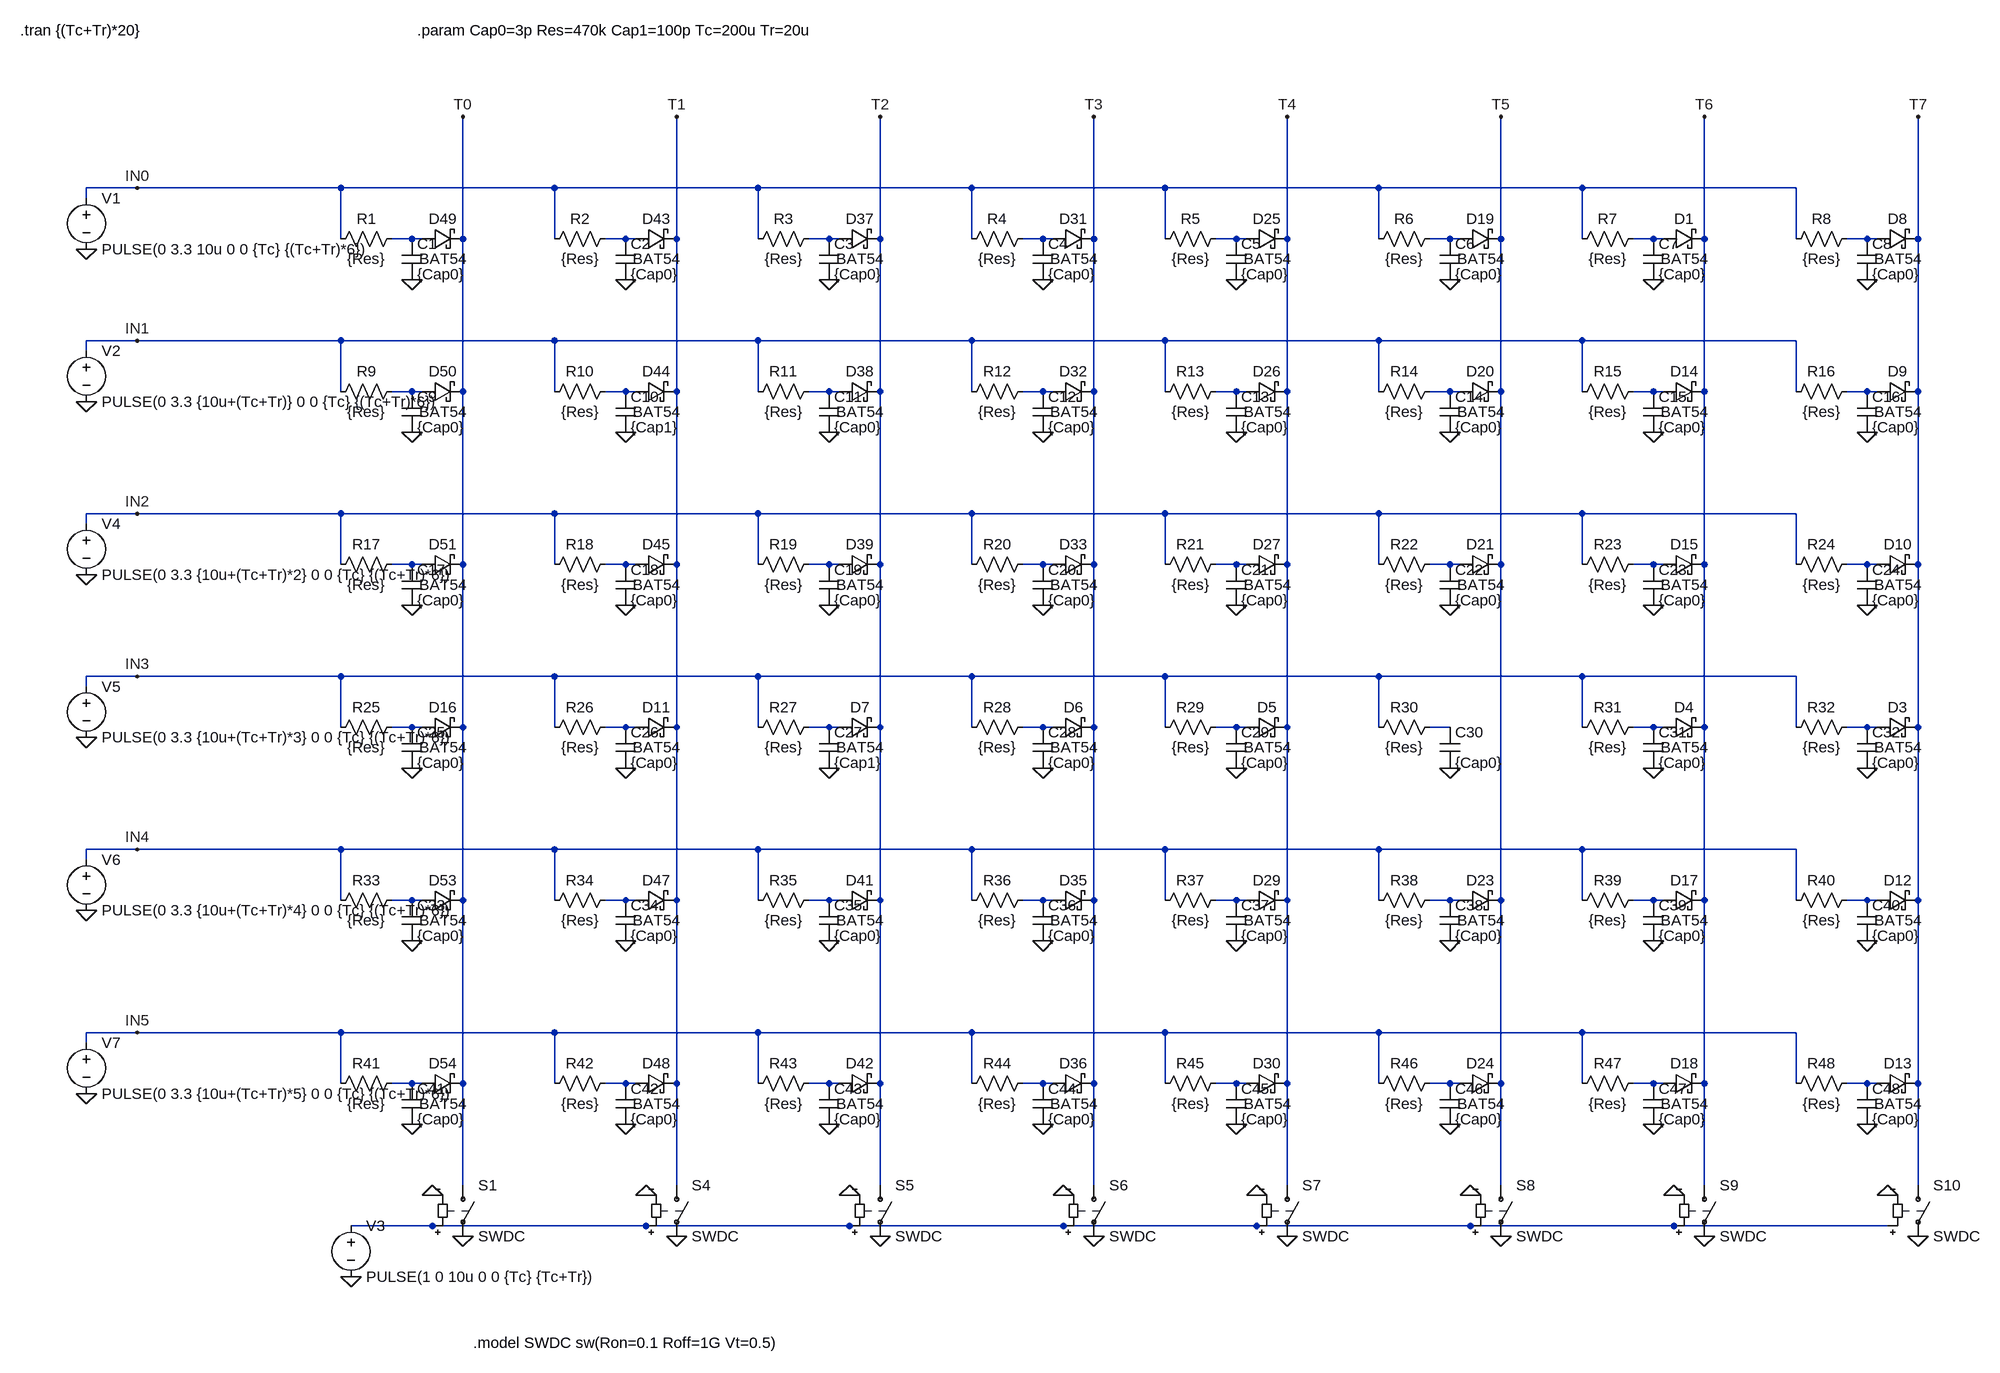
[diagram p0: schematic PadArraySim.asc]
PadArraySim.asc, the LTspice schematic file:
Version 4
SHEET 1 2744 2100
WIRE -336 128 -416 128
WIRE -16 128 -336 128
WIRE 320 128 -16 128
WIRE 640 128 320 128
WIRE 976 128 640 128
WIRE 1280 128 976 128
WIRE 1616 128 1280 128
WIRE 1936 128 1616 128
WIRE 2272 128 1936 128
WIRE -416 144 -416 128
WIRE -16 208 -16 128
WIRE 96 208 64 208
WIRE 112 208 96 208
WIRE 176 208 176 16
WIRE 320 208 320 128
WIRE 432 208 400 208
WIRE 448 208 432 208
WIRE 512 208 512 16
WIRE 640 208 640 128
WIRE 752 208 720 208
WIRE 768 208 752 208
WIRE 832 208 832 16
WIRE 976 208 976 128
WIRE 1088 208 1056 208
WIRE 1104 208 1088 208
WIRE 1168 208 1168 16
WIRE 1280 208 1280 128
WIRE 1392 208 1360 208
WIRE 1408 208 1392 208
WIRE 1472 208 1472 16
WIRE 1616 208 1616 128
WIRE 1728 208 1696 208
WIRE 1744 208 1728 208
WIRE 1808 208 1808 16
WIRE 1936 208 1936 128
WIRE 2048 208 2016 208
WIRE 2064 208 2048 208
WIRE 2128 208 2128 16
WIRE 2272 208 2272 128
WIRE 2384 208 2352 208
WIRE 2400 208 2384 208
WIRE 2464 208 2464 16
WIRE -336 368 -416 368
WIRE -16 368 -336 368
WIRE 320 368 -16 368
WIRE 640 368 320 368
WIRE 976 368 640 368
WIRE 1280 368 976 368
WIRE 1616 368 1280 368
WIRE 1936 368 1616 368
WIRE 2272 368 1936 368
WIRE -416 384 -416 368
WIRE -16 448 -16 368
WIRE 96 448 64 448
WIRE 112 448 96 448
WIRE 176 448 176 208
WIRE 320 448 320 368
WIRE 432 448 400 448
WIRE 448 448 432 448
WIRE 512 448 512 208
WIRE 640 448 640 368
WIRE 752 448 720 448
WIRE 768 448 752 448
WIRE 832 448 832 208
WIRE 976 448 976 368
WIRE 1088 448 1056 448
WIRE 1104 448 1088 448
WIRE 1168 448 1168 208
WIRE 1280 448 1280 368
WIRE 1392 448 1360 448
WIRE 1408 448 1392 448
WIRE 1472 448 1472 208
WIRE 1616 448 1616 368
WIRE 1728 448 1696 448
WIRE 1744 448 1728 448
WIRE 1808 448 1808 208
WIRE 1936 448 1936 368
WIRE 2048 448 2016 448
WIRE 2064 448 2048 448
WIRE 2128 448 2128 208
WIRE 2272 448 2272 368
WIRE 2384 448 2352 448
WIRE 2400 448 2384 448
WIRE 2464 448 2464 208
WIRE -336 640 -416 640
WIRE -16 640 -336 640
WIRE 320 640 -16 640
WIRE 640 640 320 640
WIRE 976 640 640 640
WIRE 1280 640 976 640
WIRE 1616 640 1280 640
WIRE 1936 640 1616 640
WIRE 2272 640 1936 640
WIRE -416 656 -416 640
WIRE -16 720 -16 640
WIRE 96 720 64 720
WIRE 112 720 96 720
WIRE 176 720 176 448
WIRE 320 720 320 640
WIRE 432 720 400 720
WIRE 448 720 432 720
WIRE 512 720 512 448
WIRE 640 720 640 640
WIRE 752 720 720 720
WIRE 768 720 752 720
WIRE 832 720 832 448
WIRE 976 720 976 640
WIRE 1088 720 1056 720
WIRE 1104 720 1088 720
WIRE 1168 720 1168 448
WIRE 1280 720 1280 640
WIRE 1392 720 1360 720
WIRE 1408 720 1392 720
WIRE 1472 720 1472 448
WIRE 1616 720 1616 640
WIRE 1728 720 1696 720
WIRE 1744 720 1728 720
WIRE 1808 720 1808 448
WIRE 1936 720 1936 640
WIRE 2048 720 2016 720
WIRE 2064 720 2048 720
WIRE 2128 720 2128 448
WIRE 2272 720 2272 640
WIRE 2384 720 2352 720
WIRE 2400 720 2384 720
WIRE 2464 720 2464 448
WIRE -336 896 -416 896
WIRE -16 896 -336 896
WIRE 320 896 -16 896
WIRE 640 896 320 896
WIRE 976 896 640 896
WIRE 1280 896 976 896
WIRE 1616 896 1280 896
WIRE 1936 896 1616 896
WIRE 2272 896 1936 896
WIRE -416 912 -416 896
WIRE -16 976 -16 896
WIRE 96 976 64 976
WIRE 112 976 96 976
WIRE 176 976 176 720
WIRE 320 976 320 896
WIRE 432 976 400 976
WIRE 448 976 432 976
WIRE 512 976 512 720
WIRE 640 976 640 896
WIRE 752 976 720 976
WIRE 768 976 752 976
WIRE 832 976 832 720
WIRE 976 976 976 896
WIRE 1088 976 1056 976
WIRE 1104 976 1088 976
WIRE 1168 976 1168 720
WIRE 1280 976 1280 896
WIRE 1392 976 1360 976
WIRE 1408 976 1392 976
WIRE 1472 976 1472 720
WIRE 1616 976 1616 896
WIRE 1728 976 1696 976
WIRE 1936 976 1936 896
WIRE 2048 976 2016 976
WIRE 2064 976 2048 976
WIRE 2128 976 2128 720
WIRE 2272 976 2272 896
WIRE 2384 976 2352 976
WIRE 2400 976 2384 976
WIRE 2464 976 2464 720
WIRE -336 1168 -416 1168
WIRE -16 1168 -336 1168
WIRE 320 1168 -16 1168
WIRE 640 1168 320 1168
WIRE 976 1168 640 1168
WIRE 1280 1168 976 1168
WIRE 1616 1168 1280 1168
WIRE 1936 1168 1616 1168
WIRE 2272 1168 1936 1168
WIRE -416 1184 -416 1168
WIRE -16 1248 -16 1168
WIRE 96 1248 64 1248
WIRE 112 1248 96 1248
WIRE 176 1248 176 976
WIRE 320 1248 320 1168
WIRE 432 1248 400 1248
WIRE 448 1248 432 1248
WIRE 512 1248 512 976
WIRE 640 1248 640 1168
WIRE 752 1248 720 1248
WIRE 768 1248 752 1248
WIRE 832 1248 832 976
WIRE 976 1248 976 1168
WIRE 1088 1248 1056 1248
WIRE 1104 1248 1088 1248
WIRE 1168 1248 1168 976
WIRE 1280 1248 1280 1168
WIRE 1392 1248 1360 1248
WIRE 1408 1248 1392 1248
WIRE 1472 1248 1472 976
WIRE 1616 1248 1616 1168
WIRE 1728 1248 1696 1248
WIRE 1744 1248 1728 1248
WIRE 1808 1248 1808 720
WIRE 1936 1248 1936 1168
WIRE 2048 1248 2016 1248
WIRE 2064 1248 2048 1248
WIRE 2128 1248 2128 976
WIRE 2272 1248 2272 1168
WIRE 2384 1248 2352 1248
WIRE 2400 1248 2384 1248
WIRE 2464 1248 2464 976
WIRE -336 1456 -416 1456
WIRE -16 1456 -336 1456
WIRE 320 1456 -16 1456
WIRE 640 1456 320 1456
WIRE 976 1456 640 1456
WIRE 1280 1456 976 1456
WIRE 1616 1456 1280 1456
WIRE 1936 1456 1616 1456
WIRE 2272 1456 1936 1456
WIRE -416 1472 -416 1456
WIRE -16 1536 -16 1456
WIRE 96 1536 64 1536
WIRE 112 1536 96 1536
WIRE 176 1536 176 1248
WIRE 320 1536 320 1456
WIRE 432 1536 400 1536
WIRE 448 1536 432 1536
WIRE 512 1536 512 1248
WIRE 640 1536 640 1456
WIRE 752 1536 720 1536
WIRE 768 1536 752 1536
WIRE 832 1536 832 1248
WIRE 976 1536 976 1456
WIRE 1088 1536 1056 1536
WIRE 1104 1536 1088 1536
WIRE 1168 1536 1168 1248
WIRE 1280 1536 1280 1456
WIRE 1392 1536 1360 1536
WIRE 1408 1536 1392 1536
WIRE 1472 1536 1472 1248
WIRE 1616 1536 1616 1456
WIRE 1728 1536 1696 1536
WIRE 1744 1536 1728 1536
WIRE 1808 1536 1808 1248
WIRE 1936 1536 1936 1456
WIRE 2048 1536 2016 1536
WIRE 2064 1536 2048 1536
WIRE 2128 1536 2128 1248
WIRE 2272 1536 2272 1456
WIRE 2384 1536 2352 1536
WIRE 2400 1536 2384 1536
WIRE 2464 1536 2464 1248
WIRE 176 1696 176 1536
WIRE 512 1696 512 1536
WIRE 832 1696 832 1536
WIRE 1168 1696 1168 1536
WIRE 1472 1696 1472 1536
WIRE 1808 1696 1808 1536
WIRE 2128 1696 2128 1536
WIRE 2464 1696 2464 1536
WIRE 128 1760 0 1760
WIRE 464 1760 128 1760
WIRE 784 1760 464 1760
WIRE 1120 1760 784 1760
WIRE 1424 1760 1120 1760
WIRE 1760 1760 1424 1760
WIRE 2080 1760 1760 1760
WIRE 2416 1760 2080 1760
FLAG 96 272 0
FLAG -416 224 0
FLAG 432 272 0
FLAG 752 272 0
FLAG 1088 272 0
FLAG 1392 272 0
FLAG 1728 272 0
FLAG 2048 272 0
FLAG 2384 272 0
FLAG 176 16 T0
FLAG 512 16 T1
FLAG 832 16 T2
FLAG 1168 16 T3
FLAG 1472 16 T4
FLAG 1808 16 T5
FLAG 2128 16 T6
FLAG 2464 16 T7
FLAG -336 128 IN0
FLAG 96 512 0
FLAG 432 512 0
FLAG 752 512 0
FLAG 1088 512 0
FLAG 1392 512 0
FLAG 1728 512 0
FLAG 2048 512 0
FLAG 2384 512 0
FLAG 96 784 0
FLAG 432 784 0
FLAG 752 784 0
FLAG 1088 784 0
FLAG 1392 784 0
FLAG 1728 784 0
FLAG 2048 784 0
FLAG 2384 784 0
FLAG 96 1040 0
FLAG 432 1040 0
FLAG 752 1040 0
FLAG 1088 1040 0
FLAG 1392 1040 0
FLAG 1728 1040 0
FLAG 2048 1040 0
FLAG 2384 1040 0
FLAG 96 1312 0
FLAG 432 1312 0
FLAG 752 1312 0
FLAG 1088 1312 0
FLAG 1392 1312 0
FLAG 1728 1312 0
FLAG 2048 1312 0
FLAG 2384 1312 0
FLAG 96 1600 0
FLAG 432 1600 0
FLAG 752 1600 0
FLAG 1088 1600 0
FLAG 1392 1600 0
FLAG 1728 1600 0
FLAG 2048 1600 0
FLAG 2384 1600 0
FLAG -416 464 0
FLAG -336 368 IN1
FLAG -416 736 0
FLAG -336 640 IN2
FLAG -416 992 0
FLAG -336 896 IN3
FLAG -416 1264 0
FLAG -336 1168 IN4
FLAG -416 1552 0
FLAG -336 1456 IN5
FLAG 0 1840 0
FLAG 128 1712 0
FLAG 176 1776 0
FLAG 464 1712 0
FLAG 512 1776 0
FLAG 784 1712 0
FLAG 832 1776 0
FLAG 1120 1712 0
FLAG 1168 1776 0
FLAG 1424 1712 0
FLAG 1472 1776 0
FLAG 1760 1712 0
FLAG 1808 1776 0
FLAG 2080 1712 0
FLAG 2128 1776 0
FLAG 2416 1712 0
FLAG 2464 1776 0
SYMBOL cap 80 208 R0
SYMATTR InstName C1
SYMATTR Value {Cap0}
SYMBOL res 80 192 R90
WINDOW 0 0 56 VBottom 2
WINDOW 3 32 56 VTop 2
SYMATTR InstName R1
SYMATTR Value {Res}
SYMBOL voltage -416 128 R0
WINDOW 123 0 0 Left 0
WINDOW 39 0 0 Left 0
SYMATTR InstName V1
SYMATTR Value PULSE(0 3.3 10u 0 0 {Tc} {(Tc+Tr)*6})
SYMBOL cap 416 208 R0
SYMATTR InstName C2
SYMATTR Value {Cap0}
SYMBOL res 416 192 R90
WINDOW 0 0 56 VBottom 2
WINDOW 3 32 56 VTop 2
SYMATTR InstName R2
SYMATTR Value {Res}
SYMBOL cap 736 208 R0
SYMATTR InstName C3
SYMATTR Value {Cap0}
SYMBOL res 736 192 R90
WINDOW 0 0 56 VBottom 2
WINDOW 3 32 56 VTop 2
SYMATTR InstName R3
SYMATTR Value {Res}
SYMBOL cap 1072 208 R0
SYMATTR InstName C4
SYMATTR Value {Cap0}
SYMBOL res 1072 192 R90
WINDOW 0 0 56 VBottom 2
WINDOW 3 32 56 VTop 2
SYMATTR InstName R4
SYMATTR Value {Res}
SYMBOL cap 1376 208 R0
SYMATTR InstName C5
SYMATTR Value {Cap0}
SYMBOL res 1376 192 R90
WINDOW 0 0 56 VBottom 2
WINDOW 3 32 56 VTop 2
SYMATTR InstName R5
SYMATTR Value {Res}
SYMBOL cap 1712 208 R0
SYMATTR InstName C6
SYMATTR Value {Cap0}
SYMBOL res 1712 192 R90
WINDOW 0 0 56 VBottom 2
WINDOW 3 32 56 VTop 2
SYMATTR InstName R6
SYMATTR Value {Res}
SYMBOL cap 2032 208 R0
SYMATTR InstName C7
SYMATTR Value {Cap0}
SYMBOL res 2032 192 R90
WINDOW 0 0 56 VBottom 2
WINDOW 3 32 56 VTop 2
SYMATTR InstName R7
SYMATTR Value {Res}
SYMBOL cap 2368 208 R0
SYMATTR InstName C8
SYMATTR Value {Cap0}
SYMBOL res 2368 192 R90
WINDOW 0 0 56 VBottom 2
WINDOW 3 32 56 VTop 2
SYMATTR InstName R8
SYMATTR Value {Res}
SYMBOL cap 80 448 R0
SYMATTR InstName C9
SYMATTR Value {Cap0}
SYMBOL res 80 432 R90
WINDOW 0 0 56 VBottom 2
WINDOW 3 32 56 VTop 2
SYMATTR InstName R9
SYMATTR Value {Res}
SYMBOL cap 416 448 R0
SYMATTR InstName C10
SYMATTR Value {Cap1}
SYMBOL res 416 432 R90
WINDOW 0 0 56 VBottom 2
WINDOW 3 32 56 VTop 2
SYMATTR InstName R10
SYMATTR Value {Res}
SYMBOL cap 736 448 R0
SYMATTR InstName C11
SYMATTR Value {Cap0}
SYMBOL res 736 432 R90
WINDOW 0 0 56 VBottom 2
WINDOW 3 32 56 VTop 2
SYMATTR InstName R11
SYMATTR Value {Res}
SYMBOL cap 1072 448 R0
SYMATTR InstName C12
SYMATTR Value {Cap0}
SYMBOL res 1072 432 R90
WINDOW 0 0 56 VBottom 2
WINDOW 3 32 56 VTop 2
SYMATTR InstName R12
SYMATTR Value {Res}
SYMBOL cap 1376 448 R0
SYMATTR InstName C13
SYMATTR Value {Cap0}
SYMBOL res 1376 432 R90
WINDOW 0 0 56 VBottom 2
WINDOW 3 32 56 VTop 2
SYMATTR InstName R13
SYMATTR Value {Res}
SYMBOL cap 1712 448 R0
SYMATTR InstName C14
SYMATTR Value {Cap0}
SYMBOL res 1712 432 R90
WINDOW 0 0 56 VBottom 2
WINDOW 3 32 56 VTop 2
SYMATTR InstName R14
SYMATTR Value {Res}
SYMBOL cap 2032 448 R0
SYMATTR InstName C15
SYMATTR Value {Cap0}
SYMBOL res 2032 432 R90
WINDOW 0 0 56 VBottom 2
WINDOW 3 32 56 VTop 2
SYMATTR InstName R15
SYMATTR Value {Res}
SYMBOL cap 2368 448 R0
SYMATTR InstName C16
SYMATTR Value {Cap0}
SYMBOL res 2368 432 R90
WINDOW 0 0 56 VBottom 2
WINDOW 3 32 56 VTop 2
SYMATTR InstName R16
SYMATTR Value {Res}
SYMBOL cap 80 720 R0
SYMATTR InstName C17
SYMATTR Value {Cap0}
SYMBOL res 80 704 R90
WINDOW 0 0 56 VBottom 2
WINDOW 3 32 56 VTop 2
SYMATTR InstName R17
SYMATTR Value {Res}
SYMBOL cap 416 720 R0
SYMATTR InstName C18
SYMATTR Value {Cap0}
SYMBOL res 416 704 R90
WINDOW 0 0 56 VBottom 2
WINDOW 3 32 56 VTop 2
SYMATTR InstName R18
SYMATTR Value {Res}
SYMBOL cap 736 720 R0
SYMATTR InstName C19
SYMATTR Value {Cap0}
SYMBOL res 736 704 R90
WINDOW 0 0 56 VBottom 2
WINDOW 3 32 56 VTop 2
SYMATTR InstName R19
SYMATTR Value {Res}
SYMBOL cap 1072 720 R0
SYMATTR InstName C20
SYMATTR Value {Cap0}
SYMBOL res 1072 704 R90
WINDOW 0 0 56 VBottom 2
WINDOW 3 32 56 VTop 2
SYMATTR InstName R20
SYMATTR Value {Res}
SYMBOL cap 1376 720 R0
SYMATTR InstName C21
SYMATTR Value {Cap0}
SYMBOL res 1376 704 R90
WINDOW 0 0 56 VBottom 2
WINDOW 3 32 56 VTop 2
SYMATTR InstName R21
SYMATTR Value {Res}
SYMBOL cap 1712 720 R0
SYMATTR InstName C22
SYMATTR Value {Cap0}
SYMBOL res 1712 704 R90
WINDOW 0 0 56 VBottom 2
WINDOW 3 32 56 VTop 2
SYMATTR InstName R22
SYMATTR Value {Res}
SYMBOL cap 2032 720 R0
SYMATTR InstName C23
SYMATTR Value {Cap0}
SYMBOL res 2032 704 R90
WINDOW 0 0 56 VBottom 2
WINDOW 3 32 56 VTop 2
SYMATTR InstName R23
SYMATTR Value {Res}
SYMBOL cap 2368 720 R0
SYMATTR InstName C24
SYMATTR Value {Cap0}
SYMBOL res 2368 704 R90
WINDOW 0 0 56 VBottom 2
WINDOW 3 32 56 VTop 2
SYMATTR InstName R24
SYMATTR Value {Res}
SYMBOL cap 80 976 R0
SYMATTR InstName C25
SYMATTR Value {Cap0}
SYMBOL res 80 960 R90
WINDOW 0 0 56 VBottom 2
WINDOW 3 32 56 VTop 2
SYMATTR InstName R25
SYMATTR Value {Res}
SYMBOL cap 416 976 R0
SYMATTR InstName C26
SYMATTR Value {Cap0}
SYMBOL res 416 960 R90
WINDOW 0 0 56 VBottom 2
WINDOW 3 32 56 VTop 2
SYMATTR InstName R26
SYMATTR Value {Res}
SYMBOL cap 736 976 R0
SYMATTR InstName C27
SYMATTR Value {Cap1}
SYMBOL res 736 960 R90
WINDOW 0 0 56 VBottom 2
WINDOW 3 32 56 VTop 2
SYMATTR InstName R27
SYMATTR Value {Res}
SYMBOL cap 1072 976 R0
SYMATTR InstName C28
SYMATTR Value {Cap0}
SYMBOL res 1072 960 R90
WINDOW 0 0 56 VBottom 2
WINDOW 3 32 56 VTop 2
SYMATTR InstName R28
SYMATTR Value {Res}
SYMBOL cap 1376 976 R0
SYMATTR InstName C29
SYMATTR Value {Cap0}
SYMBOL res 1376 960 R90
WINDOW 0 0 56 VBottom 2
WINDOW 3 32 56 VTop 2
SYMATTR InstName R29
SYMATTR Value {Res}
SYMBOL cap 1712 976 R0
SYMATTR InstName C30
SYMATTR Value {Cap0}
SYMBOL res 1712 960 R90
WINDOW 0 0 56 VBottom 2
WINDOW 3 32 56 VTop 2
SYMATTR InstName R30
SYMATTR Value {Res}
SYMBOL cap 2032 976 R0
SYMATTR InstName C31
SYMATTR Value {Cap0}
SYMBOL res 2032 960 R90
WINDOW 0 0 56 VBottom 2
WINDOW 3 32 56 VTop 2
SYMATTR InstName R31
SYMATTR Value {Res}
SYMBOL cap 2368 976 R0
SYMATTR InstName C32
SYMATTR Value {Cap0}
SYMBOL res 2368 960 R90
WINDOW 0 0 56 VBottom 2
WINDOW 3 32 56 VTop 2
SYMATTR InstName R32
SYMATTR Value {Res}
SYMBOL cap 80 1248 R0
SYMATTR InstName C33
SYMATTR Value {Cap0}
SYMBOL res 80 1232 R90
WINDOW 0 0 56 VBottom 2
WINDOW 3 32 56 VTop 2
SYMATTR InstName R33
SYMATTR Value {Res}
SYMBOL cap 416 1248 R0
SYMATTR InstName C34
SYMATTR Value {Cap0}
SYMBOL res 416 1232 R90
WINDOW 0 0 56 VBottom 2
WINDOW 3 32 56 VTop 2
SYMATTR InstName R34
SYMATTR Value {Res}
SYMBOL cap 736 1248 R0
SYMATTR InstName C35
SYMATTR Value {Cap0}
SYMBOL res 736 1232 R90
WINDOW 0 0 56 VBottom 2
WINDOW 3 32 56 VTop 2
SYMATTR InstName R35
SYMATTR Value {Res}
SYMBOL cap 1072 1248 R0
SYMATTR InstName C36
SYMATTR Value {Cap0}
SYMBOL res 1072 1232 R90
WINDOW 0 0 56 VBottom 2
WINDOW 3 32 56 VTop 2
SYMATTR InstName R36
SYMATTR Value {Res}
SYMBOL cap 1376 1248 R0
SYMATTR InstName C37
SYMATTR Value {Cap0}
SYMBOL res 1376 1232 R90
WINDOW 0 0 56 VBottom 2
WINDOW 3 32 56 VTop 2
SYMATTR InstName R37
SYMATTR Value {Res}
SYMBOL cap 1712 1248 R0
SYMATTR InstName C38
SYMATTR Value {Cap0}
SYMBOL res 1712 1232 R90
WINDOW 0 0 56 VBottom 2
WINDOW 3 32 56 VTop 2
SYMATTR InstName R38
SYMATTR Value {Res}
SYMBOL cap 2032 1248 R0
SYMATTR InstName C39
SYMATTR Value {Cap0}
SYMBOL res 2032 1232 R90
WINDOW 0 0 56 VBottom 2
WINDOW 3 32 56 VTop 2
SYMATTR InstName R39
SYMATTR Value {Res}
SYMBOL cap 2368 1248 R0
SYMATTR InstName C40
SYMATTR Value {Cap0}
SYMBOL res 2368 1232 R90
WINDOW 0 0 56 VBottom 2
WINDOW 3 32 56 VTop 2
SYMATTR InstName R40
SYMATTR Value {Res}
SYMBOL cap 80 1536 R0
SYMATTR InstName C41
SYMATTR Value {Cap0}
SYMBOL res 80 1520 R90
WINDOW 0 0 56 VBottom 2
WINDOW 3 32 56 VTop 2
SYMATTR InstName R41
SYMATTR Value {Res}
SYMBOL cap 416 1536 R0
SYMATTR InstName C42
SYMATTR Value {Cap0}
SYMBOL res 416 1520 R90
WINDOW 0 0 56 VBottom 2
WINDOW 3 32 56 VTop 2
SYMATTR InstName R42
SYMATTR Value {Res}
SYMBOL cap 736 1536 R0
SYMATTR InstName C43
SYMATTR Value {Cap0}
SYMBOL res 736 1520 R90
WINDOW 0 0 56 VBottom 2
WINDOW 3 32 56 VTop 2
SYMATTR InstName R43
SYMATTR Value {Res}
SYMBOL cap 1072 1536 R0
SYMATTR InstName C44
SYMATTR Value {Cap0}
SYMBOL res 1072 1520 R90
WINDOW 0 0 56 VBottom 2
WINDOW 3 32 56 VTop 2
SYMATTR InstName R44
SYMATTR Value {Res}
SYMBOL cap 1376 1536 R0
SYMATTR InstName C45
SYMATTR Value {Cap0}
SYMBOL res 1376 1520 R90
WINDOW 0 0 56 VBottom 2
WINDOW 3 32 56 VTop 2
SYMATTR InstName R45
SYMATTR Value {Res}
SYMBOL cap 1712 1536 R0
SYMATTR InstName C46
SYMATTR Value {Cap0}
SYMBOL res 1712 1520 R90
WINDOW 0 0 56 VBottom 2
WINDOW 3 32 56 VTop 2
SYMATTR InstName R46
SYMATTR Value {Res}
SYMBOL cap 2032 1536 R0
SYMATTR InstName C47
SYMATTR Value {Cap0}
SYMBOL res 2032 1520 R90
WINDOW 0 0 56 VBottom 2
WINDOW 3 32 56 VTop 2
SYMATTR InstName R47
SYMATTR Value {Res}
SYMBOL cap 2368 1536 R0
SYMATTR InstName C48
SYMATTR Value {Cap0}
SYMBOL res 2368 1520 R90
WINDOW 0 0 56 VBottom 2
WINDOW 3 32 56 VTop 2
SYMATTR InstName R48
SYMATTR Value {Res}
SYMBOL voltage -416 368 R0
WINDOW 123 0 0 Left 0
WINDOW 39 0 0 Left 0
SYMATTR InstName V2
SYMATTR Value PULSE(0 3.3 {10u+(Tc+Tr)} 0 0 {Tc} {(Tc+Tr)*6})
SYMBOL voltage -416 640 R0
WINDOW 123 0 0 Left 0
WINDOW 39 0 0 Left 0
SYMATTR InstName V4
SYMATTR Value PULSE(0 3.3 {10u+(Tc+Tr)*2} 0 0 {Tc} {(Tc+Tr)*6})
SYMBOL voltage -416 896 R0
WINDOW 123 0 0 Left 0
WINDOW 39 0 0 Left 0
SYMATTR InstName V5
SYMATTR Value PULSE(0 3.3 {10u+(Tc+Tr)*3} 0 0 {Tc} {(Tc+Tr)*6})
SYMBOL voltage -416 1168 R0
WINDOW 123 0 0 Left 0
WINDOW 39 0 0 Left 0
SYMATTR InstName V6
SYMATTR Value PULSE(0 3.3 {10u+(Tc+Tr)*4} 0 0 {Tc} {(Tc+Tr)*6})
SYMBOL voltage -416 1456 R0
WINDOW 123 0 0 Left 0
WINDOW 39 0 0 Left 0
SYMATTR InstName V7
SYMATTR Value PULSE(0 3.3 {10u+(Tc+Tr)*5} 0 0 {Tc} {(Tc+Tr)*6})
SYMBOL sw 176 1680 R0
SYMATTR InstName S1
SYMATTR Value SWDC
SYMBOL voltage 0 1744 R0
WINDOW 123 0 0 Left 0
WINDOW 39 0 0 Left 0
SYMATTR InstName V3
SYMATTR Value PULSE(1 0 10u 0 0 {Tc} {Tc+Tr})
SYMBOL sw 512 1680 R0
SYMATTR InstName S4
SYMATTR Value SWDC
SYMBOL sw 832 1680 R0
SYMATTR InstName S5
SYMATTR Value SWDC
SYMBOL sw 1168 1680 R0
SYMATTR InstName S6
SYMATTR Value SWDC
SYMBOL sw 1472 1680 R0
SYMATTR InstName S7
SYMATTR Value SWDC
SYMBOL sw 1808 1680 R0
SYMATTR InstName S8
SYMATTR Value SWDC
SYMBOL sw 2128 1680 R0
SYMATTR InstName S9
SYMATTR Value SWDC
SYMBOL sw 2464 1680 R0
SYMATTR InstName S10
SYMATTR Value SWDC
SYMBOL schottky 2400 224 R270
WINDOW 0 32 32 VTop 2
WINDOW 3 0 32 VBottom 2
SYMATTR InstName D8
SYMATTR Value BAT54
SYMATTR Description Diode
SYMATTR Type diode
SYMBOL schottky 2400 464 R270
WINDOW 0 32 32 VTop 2
WINDOW 3 0 32 VBottom 2
SYMATTR InstName D9
SYMATTR Value BAT54
SYMATTR Description Diode
SYMATTR Type diode
SYMBOL schottky 2400 736 R270
WINDOW 0 32 32 VTop 2
WINDOW 3 0 32 VBottom 2
SYMATTR InstName D10
SYMATTR Value BAT54
SYMATTR Description Diode
SYMATTR Type diode
SYMBOL schottky 2400 1264 R270
WINDOW 0 32 32 VTop 2
WINDOW 3 0 32 VBottom 2
SYMATTR InstName D12
SYMATTR Value BAT54
SYMATTR Description Diode
SYMATTR Type diode
SYMBOL schottky 2400 1552 R270
WINDOW 0 32 32 VTop 2
WINDOW 3 0 32 VBottom 2
SYMATTR InstName D13
SYMATTR Value BAT54
SYMATTR Description Diode
SYMATTR Type diode
SYMBOL schottky 2064 224 R270
WINDOW 0 32 32 VTop 2
WINDOW 3 0 32 VBottom 2
SYMATTR InstName D1
SYMATTR Value BAT54
SYMATTR Description Diode
SYMATTR Type diode
SYMBOL schottky 2064 464 R270
WINDOW 0 32 32 VTop 2
WINDOW 3 0 32 VBottom 2
SYMATTR InstName D14
SYMATTR Value BAT54
SYMATTR Description Diode
SYMATTR Type diode
SYMBOL schottky 2064 736 R270
WINDOW 0 32 32 VTop 2
WINDOW 3 0 32 VBottom 2
SYMATTR InstName D15
SYMATTR Value BAT54
SYMATTR Description Diode
SYMATTR Type diode
SYMBOL schottky 2064 1264 R270
WINDOW 0 32 32 VTop 2
WINDOW 3 0 32 VBottom 2
SYMATTR InstName D17
SYMATTR Value BAT54
SYMATTR Description Diode
SYMATTR Type diode
SYMBOL schottky 2064 1552 R270
WINDOW 0 32 32 VTop 2
WINDOW 3 0 32 VBottom 2
SYMATTR InstName D18
SYMATTR Value BAT54
SYMATTR Description Diode
SYMATTR Type diode
SYMBOL schottky 1744 224 R270
WINDOW 0 32 32 VTop 2
WINDOW 3 0 32 VBottom 2
SYMATTR InstName D19
SYMATTR Value BAT54
SYMATTR Description Diode
SYMATTR Type diode
SYMBOL schottky 1744 464 R270
WINDOW 0 32 32 VTop 2
WINDOW 3 0 32 VBottom 2
SYMATTR InstName D20
SYMATTR Value BAT54
SYMATTR Description Diode
SYMATTR Type diode
SYMBOL schottky 1744 736 R270
WINDOW 0 32 32 VTop 2
WINDOW 3 0 32 VBottom 2
SYMATTR InstName D21
SYMATTR Value BAT54
SYMATTR Description Diode
SYMATTR Type diode
SYMBOL schottky 1744 1264 R270
WINDOW 0 32 32 VTop 2
WINDOW 3 0 32 VBottom 2
SYMATTR InstName D23
SYMATTR Value BAT54
SYMATTR Description Diode
SYMATTR Type diode
SYMBOL schottky 1744 1552 R270
WINDOW 0 32 32 VTop 2
WINDOW 3 0 32 VBottom 2
SYMATTR InstName D24
SYMATTR Value BAT54
SYMATTR Description Diode
SYMATTR Type diode
SYMBOL schottky 1408 224 R270
WINDOW 0 32 32 VTop 2
WINDOW 3 0 32 VBottom 2
SYMATTR InstName D25
SYMATTR Value BAT54
SYMATTR Description Diode
SYMATTR Type diode
SYMBOL schottky 1408 464 R270
WINDOW 0 32 32 VTop 2
WINDOW 3 0 32 VBottom 2
SYMATTR InstName D26
SYMATTR Value BAT54
SYMATTR Description Diode
SYMATTR Type diode
SYMBOL schottky 1408 736 R270
WINDOW 0 32 32 VTop 2
WINDOW 3 0 32 VBottom 2
SYMATTR InstName D27
SYMATTR Value BAT54
SYMATTR Description Diode
SYMATTR Type diode
SYMBOL schottky 1408 1264 R270
WINDOW 0 32 32 VTop 2
WINDOW 3 0 32 VBottom 2
SYMATTR InstName D29
SYMATTR Value BAT54
SYMATTR Description Diode
SYMATTR Type diode
SYMBOL schottky 1408 1552 R270
WINDOW 0 32 32 VTop 2
WINDOW 3 0 32 VBottom 2
SYMATTR InstName D30
SYMATTR Value BAT54
SYMATTR Description Diode
SYMATTR Type diode
SYMBOL schottky 1104 224 R270
WINDOW 0 32 32 VTop 2
WINDOW 3 0 32 VBottom 2
SYMATTR InstName D31
SYMATTR Value BAT54
SYMATTR Description Diode
SYMATTR Type diode
SYMBOL schottky 1104 464 R270
WINDOW 0 32 32 VTop 2
WINDOW 3 0 32 VBottom 2
SYMATTR InstName D32
SYMATTR Value BAT54
SYMATTR Description Diode
SYMATTR Type diode
SYMBOL schottky 1104 736 R270
WINDOW 0 32 32 VTop 2
WINDOW 3 0 32 VBottom 2
SYMATTR InstName D33
SYMATTR Value BAT54
SYMATTR Description Diode
SYMATTR Type diode
SYMBOL schottky 1104 1264 R270
WINDOW 0 32 32 VTop 2
WINDOW 3 0 32 VBottom 2
SYMATTR InstName D35
SYMATTR Value BAT54
SYMATTR Description Diode
SYMATTR Type diode
SYMBOL schottky 1104 1552 R270
WINDOW 0 32 32 VTop 2
WINDOW 3 0 32 VBottom 2
SYMATTR InstName D36
SYMATTR Value BAT54
SYMATTR Description Diode
SYMATTR Type diode
SYMBOL schottky 768 224 R270
WINDOW 0 32 32 VTop 2
WINDOW 3 0 32 VBottom 2
SYMATTR InstName D37
SYMATTR Value BAT54
SYMATTR Description Diode
SYMATTR Type diode
SYMBOL schottky 768 464 R270
WINDOW 0 32 32 VTop 2
WINDOW 3 0 32 VBottom 2
SYMATTR InstName D38
SYMATTR Value BAT54
SYMATTR Description Diode
SYMATTR Type diode
SYMBOL schottky 768 736 R270
WINDOW 0 32 32 VTop 2
WINDOW 3 0 32 VBottom 2
SYMATTR InstName D39
SYMATTR Value BAT54
SYMATTR Description Diode
SYMATTR Type diode
SYMBOL schottky 768 1264 R270
WINDOW 0 32 32 VTop 2
WINDOW 3 0 32 VBottom 2
SYMATTR InstName D41
SYMATTR Value BAT54
SYMATTR Description Diode
SYMATTR Type diode
SYMBOL schottky 768 1552 R270
WINDOW 0 32 32 VTop 2
WINDOW 3 0 32 VBottom 2
SYMATTR InstName D42
SYMATTR Value BAT54
SYMATTR Description Diode
SYMATTR Type diode
SYMBOL schottky 448 224 R270
WINDOW 0 32 32 VTop 2
WINDOW 3 0 32 VBottom 2
SYMATTR InstName D43
SYMATTR Value BAT54
SYMATTR Description Diode
SYMATTR Type diode
SYMBOL schottky 448 464 R270
WINDOW 0 32 32 VTop 2
WINDOW 3 0 32 VBottom 2
SYMATTR InstName D44
SYMATTR Value BAT54
SYMATTR Description Diode
SYMATTR Type diode
SYMBOL schottky 448 736 R270
WINDOW 0 32 32 VTop 2
WINDOW 3 0 32 VBottom 2
SYMATTR InstName D45
SYMATTR Value BAT54
SYMATTR Description Diode
SYMATTR Type diode
SYMBOL schottky 448 1264 R270
WINDOW 0 32 32 VTop 2
WINDOW 3 0 32 VBottom 2
SYMATTR InstName D47
SYMATTR Value BAT54
SYMATTR Description Diode
SYMATTR Type diode
SYMBOL schottky 448 1552 R270
WINDOW 0 32 32 VTop 2
WINDOW 3 0 32 VBottom 2
SYMATTR InstName D48
SYMATTR Value BAT54
SYMATTR Description Diode
SYMATTR Type diode
SYMBOL schottky 112 224 R270
WINDOW 0 32 32 VTop 2
WINDOW 3 0 32 VBottom 2
SYMATTR InstName D49
SYMATTR Value BAT54
SYMATTR Description Diode
SYMATTR Type diode
SYMBOL schottky 112 464 R270
WINDOW 0 32 32 VTop 2
WINDOW 3 0 32 VBottom 2
SYMATTR InstName D50
SYMATTR Value BAT54
SYMATTR Description Diode
SYMATTR Type diode
SYMBOL schottky 112 736 R270
WINDOW 0 32 32 VTop 2
WINDOW 3 0 32 VBottom 2
SYMATTR InstName D51
SYMATTR Value BAT54
SYMATTR Description Diode
SYMATTR Type diode
SYMBOL schottky 112 1264 R270
WINDOW 0 32 32 VTop 2
WINDOW 3 0 32 VBottom 2
SYMATTR InstName D53
SYMATTR Value BAT54
SYMATTR Description Diode
SYMATTR Type diode
SYMBOL schottky 112 1552 R270
WINDOW 0 32 32 VTop 2
WINDOW 3 0 32 VBottom 2
SYMATTR InstName D54
SYMATTR Value BAT54
SYMATTR Description Diode
SYMATTR Type diode
SYMBOL schottky 2400 992 R270
WINDOW 0 32 32 VTop 2
WINDOW 3 0 32 VBottom 2
SYMATTR InstName D3
SYMATTR Value BAT54
SYMATTR Description Diode
SYMATTR Type diode
SYMBOL schottky 2064 992 R270
WINDOW 0 32 32 VTop 2
WINDOW 3 0 32 VBottom 2
SYMATTR InstName D4
SYMATTR Value BAT54
SYMATTR Description Diode
SYMATTR Type diode
SYMBOL schottky 1408 992 R270
WINDOW 0 32 32 VTop 2
WINDOW 3 0 32 VBottom 2
SYMATTR InstName D5
SYMATTR Value BAT54
SYMATTR Description Diode
SYMATTR Type diode
SYMBOL schottky 1104 992 R270
WINDOW 0 32 32 VTop 2
WINDOW 3 0 32 VBottom 2
SYMATTR InstName D6
SYMATTR Value BAT54
SYMATTR Description Diode
SYMATTR Type diode
SYMBOL schottky 768 992 R270
WINDOW 0 32 32 VTop 2
WINDOW 3 0 32 VBottom 2
SYMATTR InstName D7
SYMATTR Value BAT54
SYMATTR Description Diode
SYMATTR Type diode
SYMBOL schottky 448 992 R270
WINDOW 0 32 32 VTop 2
WINDOW 3 0 32 VBottom 2
SYMATTR InstName D11
SYMATTR Value BAT54
SYMATTR Description Diode
SYMATTR Type diode
SYMBOL schottky 112 992 R270
WINDOW 0 32 32 VTop 2
WINDOW 3 0 32 VBottom 2
SYMATTR InstName D16
SYMATTR Value BAT54
SYMATTR Description Diode
SYMATTR Type diode
TEXT 104 -120 Left 2 !.param Cap0=3p Res=470k Cap1=100p Tc=200u Tr=20u
TEXT -520 -120 Left 2 !.tran {(Tc+Tr)*20}
TEXT 192 1944 Left 2 !.model SWDC sw(Ron=0.1 Roff=1G Vt=0.5)

The netlist it stands for:
* PadArraySim.asc
C1 N001 0 {Cap0}
R1 N001 IN0 {Res}
V1 IN0 0 PULSE(0 3.3 10u 0 0 {Tc} {(Tc+Tr)*6})
C2 N002 0 {Cap0}
R2 N002 IN0 {Res}
C3 N003 0 {Cap0}
R3 N003 IN0 {Res}
C4 N004 0 {Cap0}
R4 N004 IN0 {Res}
C5 N005 0 {Cap0}
R5 N005 IN0 {Res}
C6 N006 0 {Cap0}
R6 N006 IN0 {Res}
C7 N007 0 {Cap0}
R7 N007 IN0 {Res}
C8 N008 0 {Cap0}
R8 N008 IN0 {Res}
C9 N009 0 {Cap0}
R9 N009 IN1 {Res}
C10 N010 0 {Cap1}
R10 N010 IN1 {Res}
C11 N011 0 {Cap0}
R11 N011 IN1 {Res}
C12 N012 0 {Cap0}
R12 N012 IN1 {Res}
C13 N013 0 {Cap0}
R13 N013 IN1 {Res}
C14 N014 0 {Cap0}
R14 N014 IN1 {Res}
C15 N015 0 {Cap0}
R15 N015 IN1 {Res}
C16 N016 0 {Cap0}
R16 N016 IN1 {Res}
C17 N017 0 {Cap0}
R17 N017 IN2 {Res}
C18 N018 0 {Cap0}
R18 N018 IN2 {Res}
C19 N019 0 {Cap0}
R19 N019 IN2 {Res}
C20 N020 0 {Cap0}
R20 N020 IN2 {Res}
C21 N021 0 {Cap0}
R21 N021 IN2 {Res}
C22 N022 0 {Cap0}
R22 N022 IN2 {Res}
C23 N023 0 {Cap0}
R23 N023 IN2 {Res}
C24 N024 0 {Cap0}
R24 N024 IN2 {Res}
C25 N025 0 {Cap0}
R25 N025 IN3 {Res}
C26 N026 0 {Cap0}
R26 N026 IN3 {Res}
C27 N027 0 {Cap1}
R27 N027 IN3 {Res}
C28 N028 0 {Cap0}
R28 N028 IN3 {Res}
C29 N029 0 {Cap0}
R29 N029 IN3 {Res}
C30 N030 0 {Cap0}
R30 N030 IN3 {Res}
C31 N031 0 {Cap0}
R31 N031 IN3 {Res}
C32 N032 0 {Cap0}
R32 N032 IN3 {Res}
C33 N033 0 {Cap0}
R33 N033 IN4 {Res}
C34 N034 0 {Cap0}
R34 N034 IN4 {Res}
C35 N035 0 {Cap0}
R35 N035 IN4 {Res}
C36 N036 0 {Cap0}
R36 N036 IN4 {Res}
C37 N037 0 {Cap0}
R37 N037 IN4 {Res}
C38 N038 0 {Cap0}
R38 N038 IN4 {Res}
C39 N039 0 {Cap0}
R39 N039 IN4 {Res}
C40 N040 0 {Cap0}
R40 N040 IN4 {Res}
C41 N041 0 {Cap0}
R41 N041 IN5 {Res}
C42 N042 0 {Cap0}
R42 N042 IN5 {Res}
C43 N043 0 {Cap0}
R43 N043 IN5 {Res}
C44 N044 0 {Cap0}
R44 N044 IN5 {Res}
C45 N045 0 {Cap0}
R45 N045 IN5 {Res}
C46 N046 0 {Cap0}
R46 N046 IN5 {Res}
C47 N047 0 {Cap0}
R47 N047 IN5 {Res}
C48 N048 0 {Cap0}
R48 N048 IN5 {Res}
V2 IN1 0 PULSE(0 3.3 {10u+(Tc+Tr)} 0 0 {Tc} {(Tc+Tr)*6})
V4 IN2 0 PULSE(0 3.3 {10u+(Tc+Tr)*2} 0 0 {Tc} {(Tc+Tr)*6})
V5 IN3 0 PULSE(0 3.3 {10u+(Tc+Tr)*3} 0 0 {Tc} {(Tc+Tr)*6})
V6 IN4 0 PULSE(0 3.3 {10u+(Tc+Tr)*4} 0 0 {Tc} {(Tc+Tr)*6})
V7 IN5 0 PULSE(0 3.3 {10u+(Tc+Tr)*5} 0 0 {Tc} {(Tc+Tr)*6})
S1 T0 0 N049 0 SWDC
V3 N049 0 PULSE(1 0 10u 0 0 {Tc} {Tc+Tr})
S4 T1 0 N049 0 SWDC
S5 T2 0 N049 0 SWDC
S6 T3 0 N049 0 SWDC
S7 T4 0 N049 0 SWDC
S8 T5 0 N049 0 SWDC
S9 T6 0 N049 0 SWDC
S10 T7 0 N049 0 SWDC
D8 N008 T7 BAT54
D9 N016 T7 BAT54
D10 N024 T7 BAT54
D12 N040 T7 BAT54
D13 N048 T7 BAT54
D1 N007 T6 BAT54
D14 N015 T6 BAT54
D15 N023 T6 BAT54
D17 N039 T6 BAT54
D18 N047 T6 BAT54
D19 N006 T5 BAT54
D20 N014 T5 BAT54
D21 N022 T5 BAT54
D23 N038 T5 BAT54
D24 N046 T5 BAT54
D25 N005 T4 BAT54
D26 N013 T4 BAT54
D27 N021 T4 BAT54
D29 N037 T4 BAT54
D30 N045 T4 BAT54
D31 N004 T3 BAT54
D32 N012 T3 BAT54
D33 N020 T3 BAT54
D35 N036 T3 BAT54
D36 N044 T3 BAT54
D37 N003 T2 BAT54
D38 N011 T2 BAT54
D39 N019 T2 BAT54
D41 N035 T2 BAT54
D42 N043 T2 BAT54
D43 N002 T1 BAT54
D44 N010 T1 BAT54
D45 N018 T1 BAT54
D47 N034 T1 BAT54
D48 N042 T1 BAT54
D49 N001 T0 BAT54
D50 N009 T0 BAT54
D51 N017 T0 BAT54
D53 N033 T0 BAT54
D54 N041 T0 BAT54
D3 N032 T7 BAT54
D4 N031 T6 BAT54
D5 N029 T4 BAT54
D6 N028 T3 BAT54
D7 N027 T2 BAT54
D11 N026 T1 BAT54
D16 N025 T0 BAT54
.model D D
.lib standard.dio
.param Cap0=3p Res=470k Cap1=100p Tc=200u Tr=20u
.tran {(Tc+Tr)*20}
.model SWDC sw(Ron=0.1 Roff=1G Vt=0.5)
.backanno
.end